# Altium schematic sheet Sheet1.SchDoc
size A4; SheetNumber: 1; SheetTotal: 1
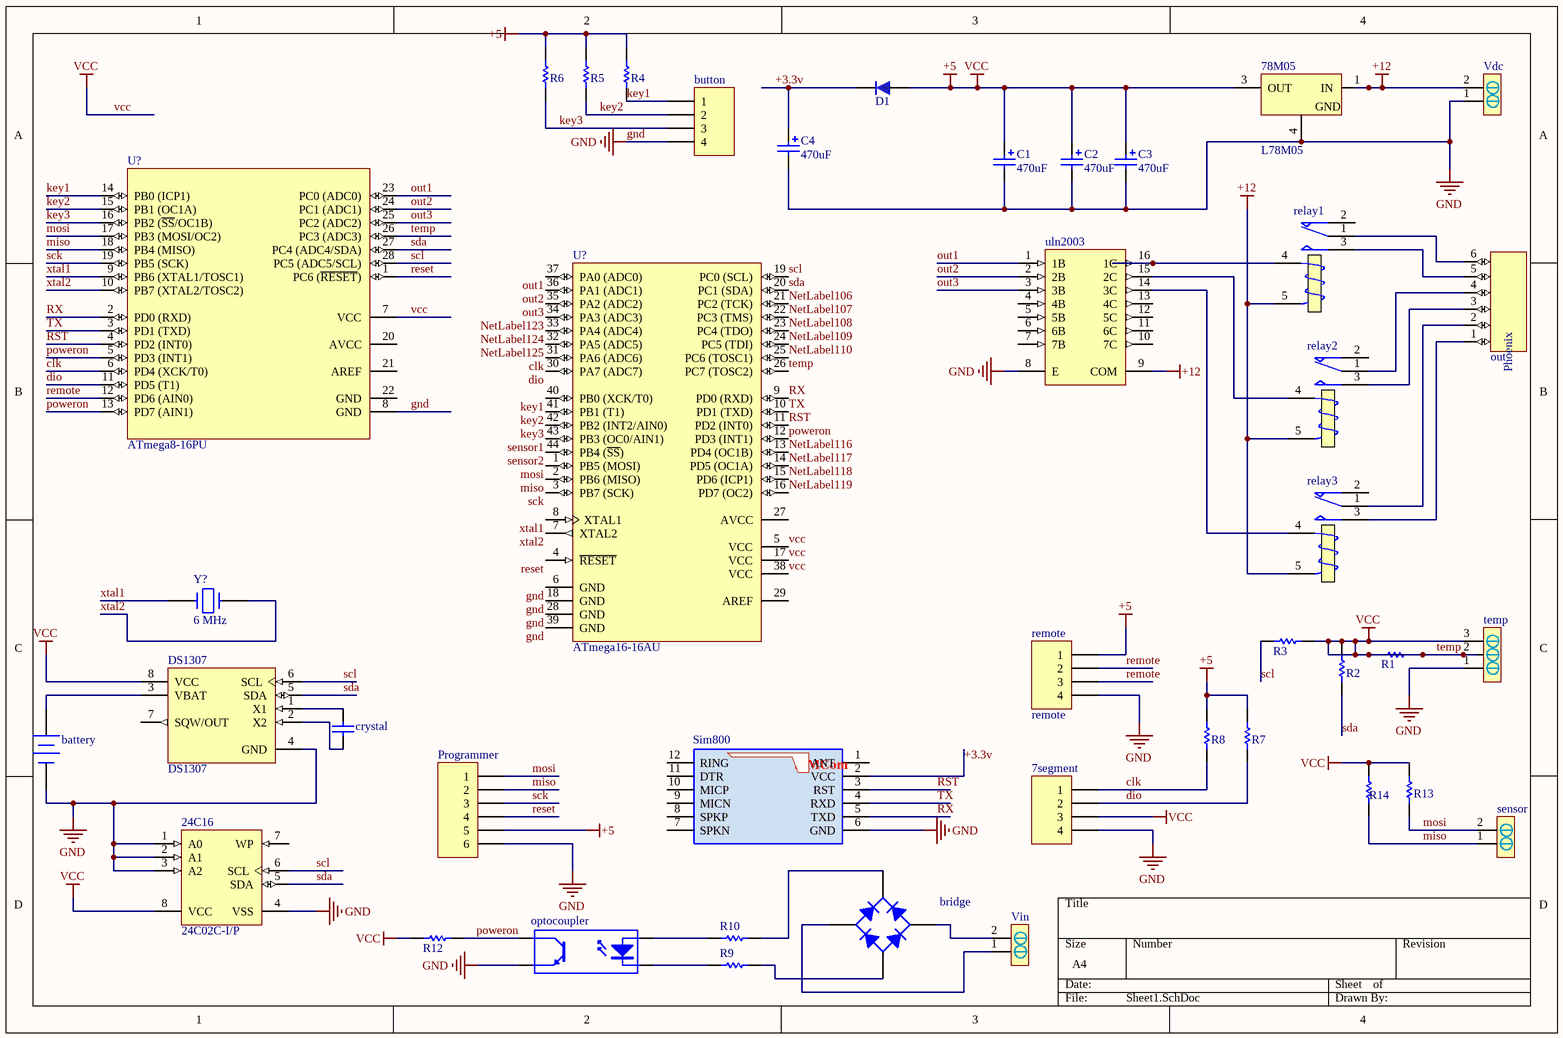
[diagram p0: Sheet1.SchDoc]

## Parts
(Parts that share a designator on the sheet are numbered #1, #2 ... from top to bottom, then left to right.)
7segment  7segment  [HDR1X4]  (value not drawn)
24C16  24C02C-I/P  [PDIP300-P8]
78M05  L78M05  [TO-252]
battery  BATTERY 3V 1220  [BATT SMD]  (value not drawn)
bridge  Bridge KBU PACKAGE  [Bridge KBU PACKAGE]  (value not drawn)
button  button  [HDR1X4]  (value not drawn)
C1  470uF  [CAP_POL5]
C2  470uF  [CAP_POL5]
C3  470uF  [CAP_POL5]
C4  470uF  [CAP_POL5]
crystal  22pF  [XTAL-DT26]  (value not drawn)
D1  1n4007  [DIOM4629X24N]  (value not drawn)
DS1307  DS1307  [DIP8]
optocoupler  Optoisolator1  [DIP-4]  (value not drawn)
out  PHOENIX 6  [phonix 6]  (value not drawn)
Programmer  programmer  [HDR1X6]  (value not drawn)
R1  RES  [CC2012-0805]  (value not drawn)
R2  RES  [CC2012-0805]  (value not drawn)
R3  RES  [CC2012-0805]  (value not drawn)
R4  RES  [CC2012-0805]  (value not drawn)
R5  RES  [CC2012-0805]  (value not drawn)
R6  RES  [CC2012-0805]  (value not drawn)
R7  RES  [CC2012-0805]  (value not drawn)
R8  RES  [CC2012-0805]  (value not drawn)
R9  1K  [Axial 1W  7_0mm]  (value not drawn)
R10  1K  [Axial 1W  7_0mm]  (value not drawn)
R12  RES  [CC2012-0805]  (value not drawn)
R13  RES  [CC2012-0805]  (value not drawn)
R14  RES  [CC2012-0805]  (value not drawn)
relay1  (no value)  [Relay 18.85x15.35x15.70]
relay2  (no value)  [Relay 18.85x15.35x15.70]
relay3  (no value)  [Relay 18.85x15.35x15.70]
remote  remote  [HDR1X4]
sensor  PHONIX2  [PHONIX2]  (value not drawn)
Sim800  SIM800L  [SIM800L_L250W236H60]  (value not drawn)
temp  PHONIX3  [PHONIX3]  (value not drawn)
U?#1  ATmega8-16PU  [28P3]
U?#2  ATmega16-16AU  [44A_M]
uln2003  ULN2003AN  [N0016A]  (value not drawn)
Vdc  PHONIX2  [PHONIX2]  (value not drawn)
Vin  PHONIX2  [PHONIX2]  (value not drawn)
Y?  6 MHz  [My_Crystal]

## Nets
+12: 78M05.1(IN) relay1.5(T2) relay2.5(T2) relay3.5(T2) uln2003.9(COM) Vdc.2
gnd: 7segment.4 24C16.1(A0) 24C16.2(A1) 24C16.3(A2) 24C16.4(VSS) 78M05.4(GND) battery.2(-) button.4 C1.2 C2.2 C3.2 C4.2 DS1307.4(GND) optocoupler.3(E) Programmer.6 remote.4 Sim800.6(GND) temp.1 U?#1.8(GND) U?#2.6(GND) U?#2.18(GND) U?#2.28(GND) U?#2.39(GND) uln2003.8(E) Vdc.1
temp: 7segment.3 24C16.8(VCC) 78M05.3(OUT) C1.1 C2.1 C3.1 D1.1 DS1307.8(VCC) Programmer.5 R1.1 R1.2 R2.2 R3.2 R4.2 R5.2 R6.2 R7.2 R8.2 R12.2 R13.2 R14.2 remote.1 temp.2 temp.3 U?#1.7(VCC) U?#1.26(PC3_(ADC3)) U?#2.5(VCC) U?#2.17(VCC) U?#2.26(PC7_(TOSC2)) U?#2.38(VCC)  [also labelled +5, VCC]
+3.3v: C4.1 D1.2 Sim800.2(VCC)
clk: 7segment.1 R8.1 U?#1.6(PD4_(XCK/T0)) U?#2.31(PA6_(ADC6))
dio: 7segment.2 R7.1 U?#1.11(PD5_(T1)) U?#2.30(PA7_(ADC7))
key1: button.1 R4.1 U?#1.14(PB0_(ICP1)) U?#2.40(PB0_(XCK/T0))
key2: button.2 R5.1 U?#1.15(PB1_(OC1A)) U?#2.41(PB1_(T1))
key3: button.3 R6.1 U?#1.16(PB2_(~{SS}/OC1B)) U?#2.42(PB2_(INT2/AIN0))
miso: Programmer.2 R14.1 sensor.1 U?#1.18(PB4_(MISO)) U?#2.2(PB6_(MISO))
mosi: Programmer.1 R13.1 sensor.2 U?#1.17(PB3_(MOSI/OC2)) U?#2.1(PB5_(MOSI))
NetLabel106: U?#2.21(PC2_(TCK))
NetLabel107: U?#2.22(PC3_(TMS))
NetLabel108: U?#2.23(PC4_(TDO))
NetLabel109: U?#2.24(PC5_(TDI))
NetLabel110: U?#2.25(PC6_(TOSC1))
NetLabel116: U?#2.13(PD4_(OC1B))
NetLabel117: U?#2.14(PD5_(OC1A))
NetLabel118: U?#2.15(PD6_(ICP1))
NetLabel119: U?#2.16(PD7_(OC2))
NetLabel123: U?#2.34(PA3_(ADC3))
NetLabel124: U?#2.33(PA4_(ADC4))
NetLabel125: U?#2.32(PA5_(ADC5))
out1: U?#1.23(PC0_(ADC0)) U?#2.37(PA0_(ADC0)) uln2003.1(1B)
out2: U?#1.24(PC1_(ADC1)) U?#2.36(PA1_(ADC1)) uln2003.2(2B)
out3: U?#1.25(PC2_(ADC2)) U?#2.35(PA2_(ADC2)) uln2003.3(3B)
poweron: optocoupler.4(C) R12.1 U?#1.5(PD3_(INT1)) U?#1.13(PD7_(AIN1)) U?#2.12(PD3_(INT1))
remote: remote.2 remote.3 U?#1.12(PD6_(AIN0))
reset: Programmer.4 U?#1.1(PC6_(~{RESET})) U?#2.4(~{RESET})
RST: Sim800.3(RST) U?#1.4(PD2_(INT0)) U?#2.11(PD2_(INT0))
RX: Sim800.5(TXD) U?#1.2(PD0_(RXD)) U?#2.9(PD0_(RXD))
sck: Programmer.3 U?#1.19(PB5_(SCK)) U?#2.3(PB7_(SCK))
scl: 24C16.6(SCL) DS1307.6(SCL) R3.1 U?#1.28(PC5_(ADC5/SCL)) U?#2.19(PC0_(SCL))
sda: 24C16.5(SDA) DS1307.5(SDA) R2.1 U?#1.27(PC4_(ADC4/SDA)) U?#2.20(PC1_(SDA))
sensor1: U?#2.43(PB3_(OC0/AIN1))
sensor2: U?#2.44(PB4_(~{SS}))
TX: Sim800.4(RXD) U?#1.3(PD1_(TXD)) U?#2.10(PD1_(TXD))
xtal1: U?#1.9(PB6_(XTAL1/TOSC1)) U?#2.8(XTAL1) Y?.1
xtal2: U?#1.10(PB7_(XTAL2/TOSC2)) U?#2.7(XTAL2) Y?.2
Netbattery_1: battery.1(+) DS1307.3(VBAT)
Netbridge_1: bridge.1(+) R10.2
Netbridge_2: bridge.2(AC) Vin.1
Netbridge_3: bridge.3(AC) Vin.2
Netbridge_4: bridge.4(-) R9.2
Netcrystal_1: crystal.1 DS1307.1(X1)
Netcrystal_2: crystal.2 DS1307.2(X2)
Netoptocoupler_1: optocoupler.1(A) R10.1
Netoptocoupler_2: optocoupler.2(K) R9.1
Netout_1: out.1 relay3.3(NO)
Netout_2: out.2 relay3.1(COM)
Netout_3: out.3 relay2.3(NO)
Netout_4: out.4 relay2.1(COM)
Netout_5: out.5 relay1.3(NO)
Netout_6: out.6 relay1.1(COM)
Netrelay1_4: relay1.4(T1) uln2003.16(1C)
Netrelay2_4: relay2.4(T1) uln2003.15(2C)
Netrelay3_4: relay3.4(T1) uln2003.14(3C)

Not connected (* = marked no-connect by the designer): 24C16 7(WP); DS1307 7(SQW/OUT); relay1 2(NC); relay2 2(NC); relay3 2(NC); Sim800 1(ANT) 7(SPKN) 8(SPKP) 9(MICN) 10(MICP) 11(DTR) 12(RING); U?#1 20(AVCC) 21(AREF) 22(GND); U?#2 27(AVCC) 29(AREF); uln2003 4(4B) 5(5B) 6(6B) 7(7B) 10(7C) 11(6C) 12(5C) 13(4C)

## Notes on the sheet
- (in symbol PHOENIX 6) Phoenix
- (in symbol SIM800L) SIMCom

## Library data of the parts
7segment button remote = Header 4: Header, 4-Pin; LatestRevisionDate: 17-Jul-2002; LatestRevisionNote: Re-released for DXP Platform.; Publisher: Altium Limited
24C16 = CMP-0159-00018-1: 2Kbit, 400kHz, 5V, I2C Serial EEPROM, 8-Pin PDIP, Industrial Temperature; PackageDescription: 8-Lead Plastic Dual In-Line (P) - 300 mil Body [PDIP]; DatasheetVersion: revJ, Aug-2008; PackageReference: PDIP300-P8; PackageVersion: revBB, Aug-2009; Code_JEDEC: MS-001
78M05 = L78M05: Precision 500mA Regulator
C1-C4 = Cap Pol3: Polarized Capacitor (Surface Mount); Value: 100pF; Published: 8-Jun-2000; Revision: July-2002: Re-released for DXP Platform.; Publisher: Altium Limited
crystal = Cap Semi_1: Capacitor (Semiconductor SIM Model); Published: 8-Jun-2000; LatestRevisionDate: 29-May-2009; LatestRevisionNote: IPC-7351 Footprint Added.; PackageReference: C1206; Publisher: Altium Limited; PackageDescription: Chip Capacitor; Value: 22pF
D1 = 1n4007 SMD M7: Standard Rectifiers; Part. No: M7; Manufacturer: DC COMPONENTS; Designer: Abbas Basereh; Link: http://www.tme.eu/en/details/m7/smd-universal-diodes/dc-components/; Link: https://www.aliexpress.com/item/Smd-tube-1n4007-m7-SMA/1213719741.html?spm=2114.01010208.3.1.ZyZ7bC&ws_ab_test=searchweb0_0,searchweb201602_4_10065_10068_10084_10083_10080_10082_10081_10060_10061_10062_10056_10055_10054_10059_10099_10078_10079_427_10073_10103_10102_10096_10052_10050_10051,searchweb201603_4&btsid=db2be5ca-e560-400a-b91c-484ab5ee228b; Data: 16-12-2016
DS1307 = DS1307: 64 X 8 Serial Real-Time Clock; Package Information: Latest Revision: 1999; Published: 13-Oct-2000; Revision: 17-Jul-2002: Re-released for DXP Platform.; Datasheet: Latest Revision: 10-Aug-1999; Package Reference: DIP8; Publisher: Altium Limited
optocoupler = Optoisolator1: 4-Pin Phototransistor Optocoupler; Published: 24-Mar-1999; LatestRevisionDate: 04-Mar-2005; LatestRevisionNote: Sch pins 3 & 4 Swapped.; DatasheetVersion: Nov-2003; PackageReference: DIP-4; Publisher: Altium Limited
Programmer = Header 6: Header, 6-Pin; LatestRevisionDate: 17-Jul-2002; LatestRevisionNote: Re-released for DXP Platform.; Publisher: Altium Limited
R1-R8 R12-R14 = RES: Resistor; Published: 5-Jan-2004; DatasheetDocument: Nov-2002; Publisher: Altium Limited
R9 R10 = RES Axial 1W: Designer: Abbas Basereh; Desc.: RES Axial 1W; Data: 4-1-2017
relay1-relay3 = RELAY_SPDT: Single-Pole Dual-Throw Relay; Designer: Abbas Basereh; Mounting Technology: Through-Hole; ComponentLink1Description: Datasheet; Pin Count: 0; Update Date: 2017-3-1
Sim800 = SIM800L: GSM/GPRS Module; Publisher: 3DFootprint.ir
U?#1 = CMP-0095-00372-1: 8-bit AVR Microcontroller, 4.5-5.5V, 16MHz, 8KB Flash, 512 Bytes EEPROM, 1KB SRAM, 28-pin PDIP, Industrial Grade (-40°C to 85°C); ComponentLink3URL: http://www.atmel.com/dyn/resources/prod_documents/2486S.pdf; ComponentLink3Description: ATmega8(L) Summary; PackageDescription: 28-lead (0.300"/7.62mm Wide) Plastic Dual Inline Package (PDIP); ComponentLink2Description: ATmega8(L); ComponentLink1URL: http://www.atmel.com/; PackageVersion: revB, Sep-2001; ComponentLink1Description: Manufacturer URL; ComponentLink2URL: http://www.atmel.com/dyn/resources/prod_documents/doc2486.pdf; PackageReference: 28P3; DatasheetVersion: revZ, Feb-2011
U?#2 = CMP-0095-00235-2: 8-bit AVR Microcontroller, 4.5-5.5V, 16KB Flash, 512 Bytes EEPROM, 1KB SRAM, 44-pin TQFP, Industrial Grade (-40°C to 85°C), Pb-Free; ComponentLink3URL: http://www.atmel.com/dyn/resources/prod_documents/2466S.pdf; ComponentLink1URL: http://www.atmel.com/; ComponentLink1Description: Manufacturer URL; Code_JEDEC: MS-026-ACB; ComponentLink2URL: http://www.atmel.com/dyn/resources/prod_documents/doc2466.pdf; DatasheetVersion: revT, Jul-2010; ComponentLink2Description: ATmega16(L)  Datasheet; PackageReference: 44A; PackageDescription: 44-Pin Plastic Thin Profile Quad Flat Pack, 10 x 10 x 1.0 mm Body, 0.8 mm Pitch (TQFP); RevisionNote: DatasheetVersion & PackageVersion updated. URLs added.; ComponentLink3Description: ATmega16(L) Summary; PackageVersion: revC, Oct-2010
uln2003 = CMP-2000-07352-1: High-Voltage, High-Current Darlington Transistor Array, 50 V, 500 mA, -20 to 70 degC, 16-Pin PDIP (N), Pb-Free (RoHS), Tube; Manufacturer: TexasInstruments; Maximum Collector Emitter Saturation Voltage: 1.1@100mA; Peak DC Collector Current: 0.5A; Package Version: 4040049/E, 12/2002; Configuration: Array7; Maximum Collector Emitter Voltage: 50V; Rad Hard: No; Mounting: ThroughHole; Datasheet URL: http://www.ti.com/general/docs/lit/getliterature.tsp?genericPartNumber=uln2003a&fileType=pdf; Package: 16PDIP; Package Reference: N16; Datasheet Version: Rev. O, 01/2016; Mounting Technology: ThroughHole; Package Description: 16-Pin Plastic In-Line, Body 19.305 x 6.35 mm, Pitch 2.54 mm; Manufacturer URL: http://www.ti.com/; Type: NPN; Category: DarlingtonBJT; Package URL: http://www.ti.com/litv/pdf/mpdi002c; Packaging: Rail/Tube
Y? = CRYSTAL